# EAGLE design linefollower (EAGLE 9.6.2)
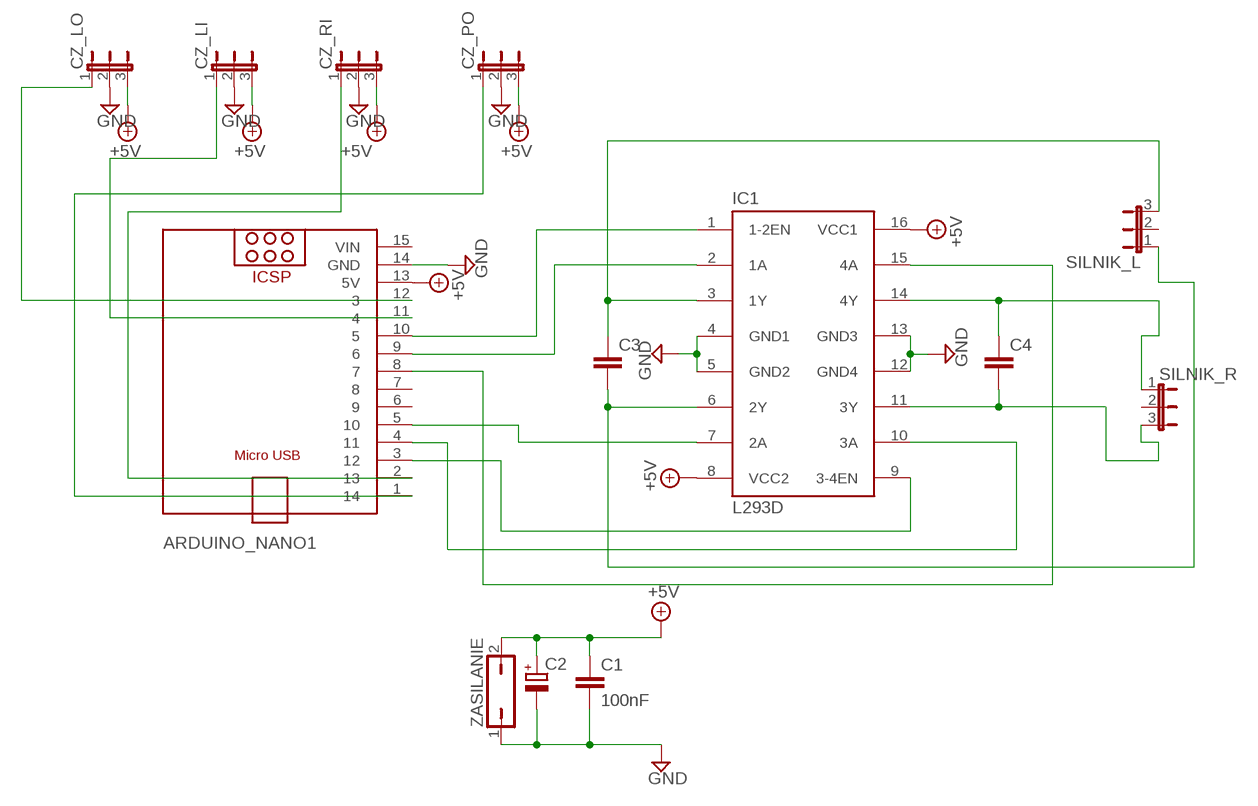
[diagram p0: schematic, sheet 1]

## Parts
ARDUINO_NANO1  MH-TINY  [MH-TINY]
C1  100nF  C-EU025-025X050  [C025-025X050]
C2  CPOL-EUE3.5-8  [E3,5-8]
C3  C-EU050-025X075  [C050-025X075]
C4  C-EU050-025X075  [C050-025X075]
CZ_LI  JP2E  [JP2]
CZ_LO  JP2E  [JP2]
CZ_PO  JP2E  [JP2]
CZ_RI  JP2E  [JP2]
IC1  L293D  [DIL16]
SILNIK_L  JP2E  [JP2]
SILNIK_R  JP2E  [JP2]
ZASILANIE  JP1Q  [JP1]

## Nets
+5V: ARDUINO_NANO1.13(5V) C1.1 C2.+ CZ_LI.3 CZ_LO.3 CZ_PO.3 CZ_RI.3 IC1.8(VCC2) IC1.16(VCC1) ZASILANIE.2
GND: ARDUINO_NANO1.14(GND) C1.2 C2.- CZ_LI.2 CZ_LO.2 CZ_PO.2 CZ_RI.2 IC1.4(GND1) IC1.5(GND2) IC1.12(GND4) IC1.13(GND3) ZASILANIE.1
N$1: ARDUINO_NANO1.12 CZ_LO.1
N$2: ARDUINO_NANO1.1 CZ_PO.1
N$4: ARDUINO_NANO1.2 CZ_RI.1
N$5: C3.1 IC1.3(1Y) SILNIK_L.3
N$6: C3.2 IC1.6(2Y) SILNIK_L.1
N$7: C4.1 IC1.14(4Y) SILNIK_R.1
N$9: ARDUINO_NANO1.10 IC1.1(1-2EN)
N$10: ARDUINO_NANO1.9 IC1.2(1A)
N$11: ARDUINO_NANO1.5 IC1.7(2A)
N$12: ARDUINO_NANO1.8 IC1.15(4A)
N$13: ARDUINO_NANO1.4 IC1.10(3A)
N$14: ARDUINO_NANO1.3 IC1.9(3-4EN)
N$15: C4.2 IC1.11(3Y) SILNIK_R.3
N$16: ARDUINO_NANO1.11 CZ_LI.1
Unconnected: ARDUINO_NANO1.6 ARDUINO_NANO1.7 SILNIK_L.2 SILNIK_R.2

## Power pins joined to a net without a drawn wire
VIN: ARDUINO_NANO1.15(VIN)

## Library data of the parts
ARDUINO_NANO1 = MH-TINY:MH-TINY: MH-TINY
C1 C3 C4 = rcl:C-EU: CAPACITOR, European symbol; SPICEPREFIX: C
C2 = rcl:CPOL-EU: POLARIZED CAPACITOR, European symbol; SPICEPREFIX: C
CZ_LI CZ_LO CZ_PO CZ_RI SILNIK_L SILNIK_R = jumper:JP2E: JUMPER
IC1 = st-microelectronics:L293D: PUSH-PULL 4 CHANNEL DRIVER; MPN: L293D; OC_FARNELL: 9589619; OC_NEWARK: 56P8249
ZASILANIE = jumper:JP1Q: JUMPER

## Board
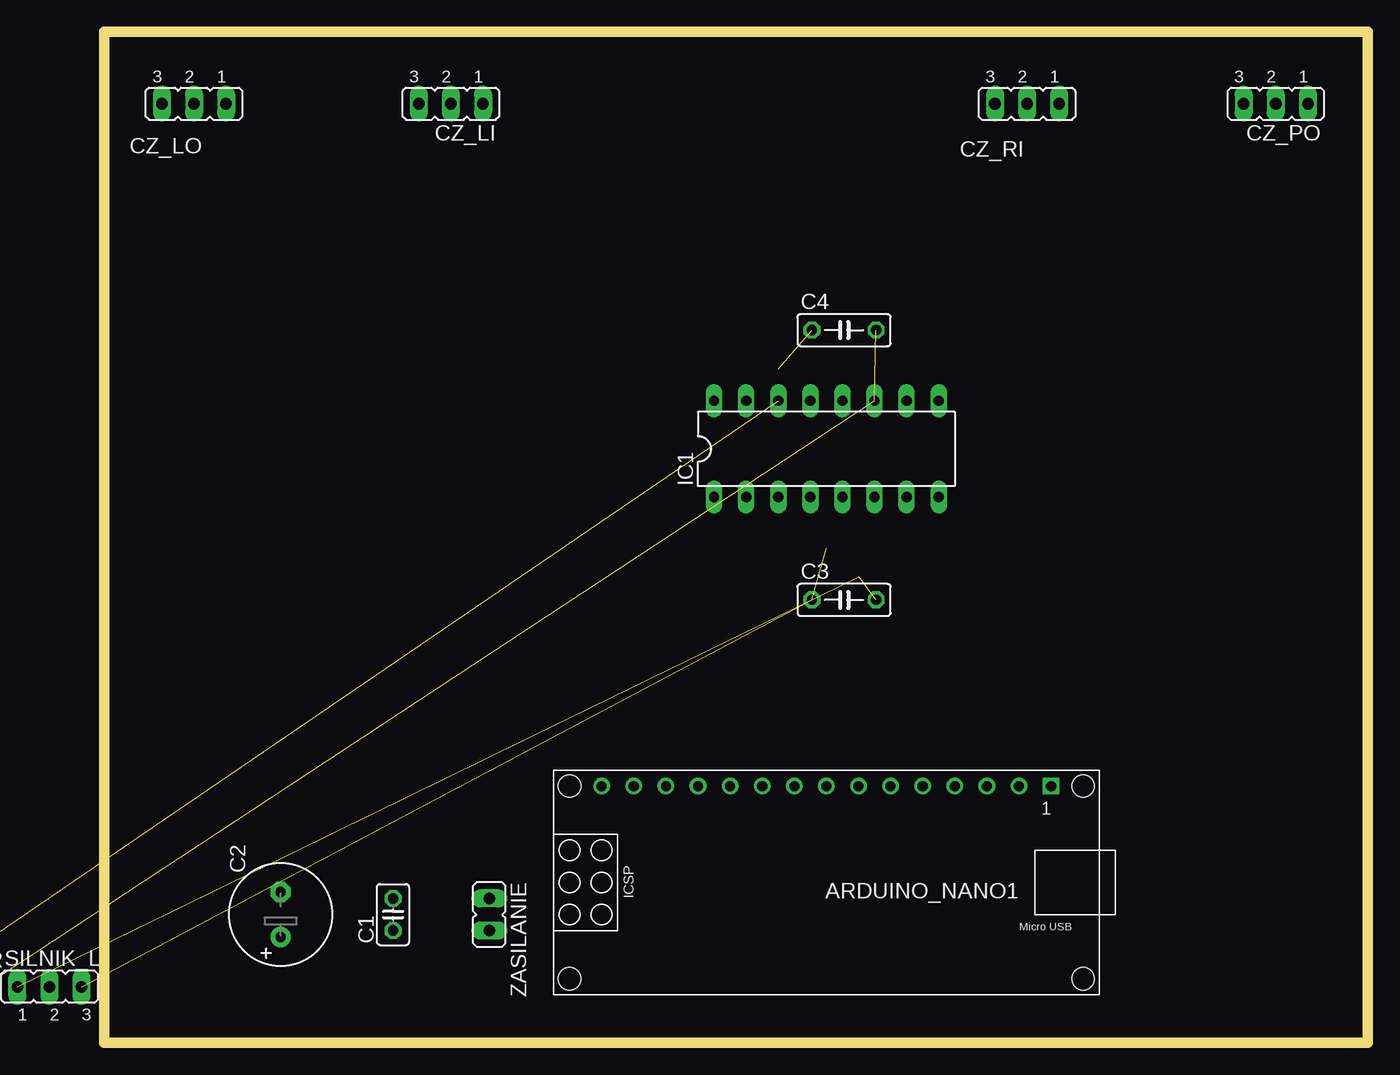
[diagram p1: board, top side]
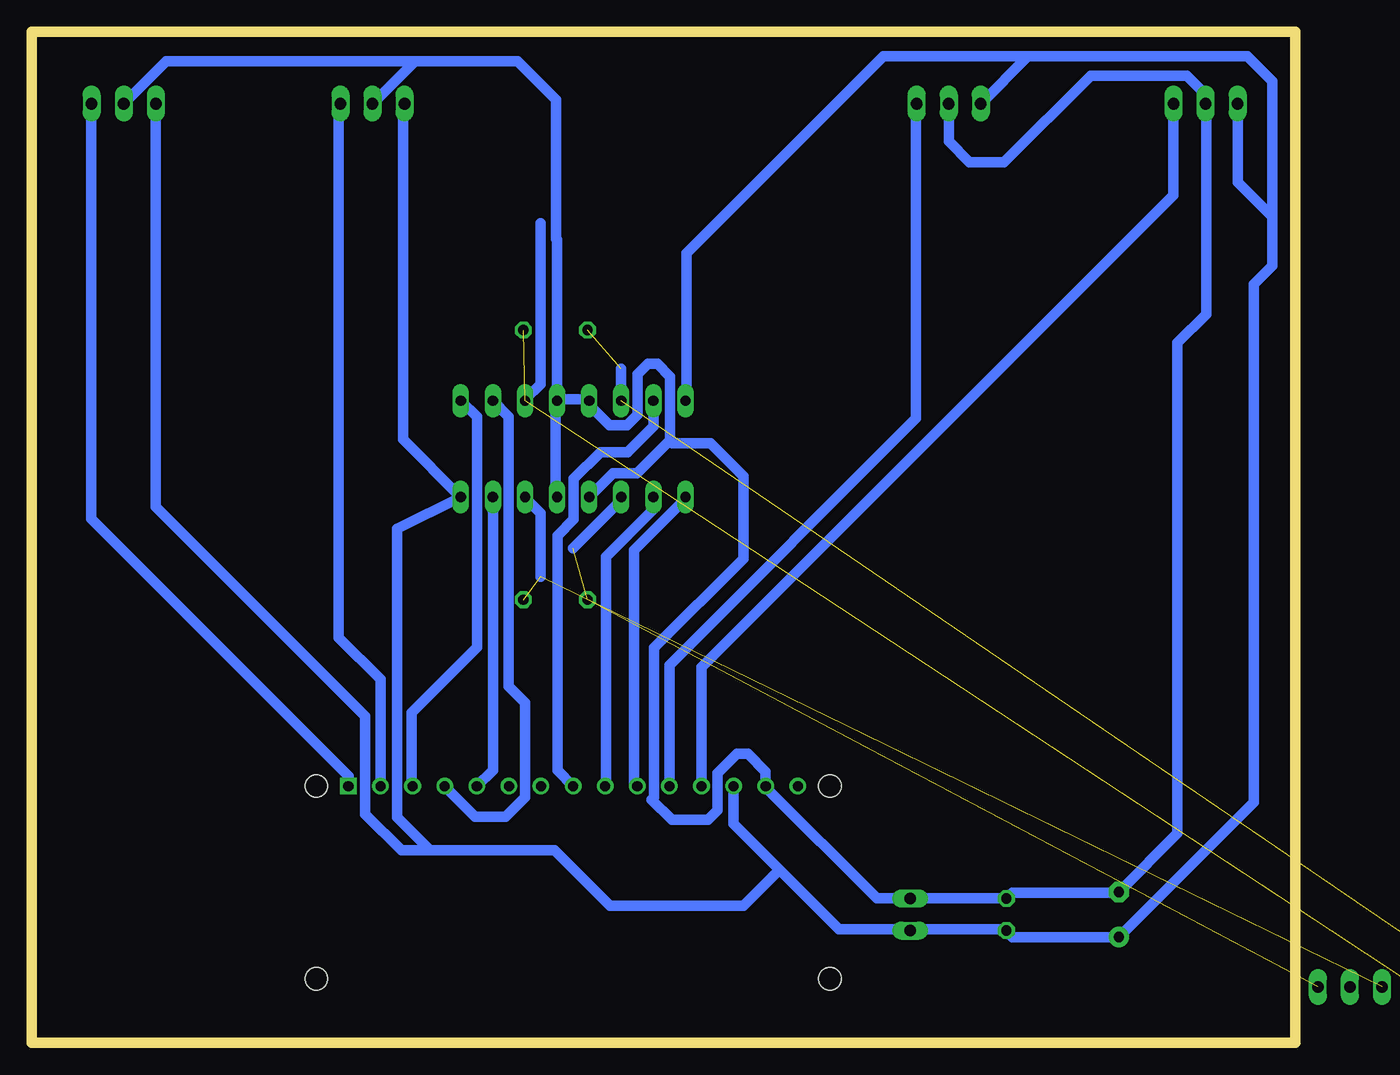
[diagram p2: board, bottom side, seen from below]

Size 100 x 80 mm. Coordinates in mm from the lower left corner, seen from the top.
Outline: 0,0 100,0 100,80 0,80 0,0
Copper layers (1*16): Top 0.035mm / dielectric 1.5mm / Bottom 0.035mm
Design rules "default": minimum track width 6mil, minimum drill 0.35mm, track to track 6mil, track to pad 6mil, pad to pad 6mil, via to via 6mil, smd to smd 6mil, copper to edge 40mil, drill to drill 6mil, minimum pad ring 10mil, minimum via ring 8mil, stop-mask expansion 4mil, vias tented up to drill 0mil, thermal gap 10mil

### Footprints (pad centres in the part's own frame; a part is rotated, then mirrored left to right if it is on the bottom)
MH-TINY = drill 0.8 square: 1 -20.32,-7.62 | drill 0.8: 2 -17.78,-7.62; 3 -15.24,-7.62; 4 -12.7,-7.62; 5 -10.16,-7.62; 6 -7.62,-7.62; 7 -5.08,-7.62; 8 -2.54,-7.62; 9 0,-7.62; 10 2.54,-7.62; 11 5.08,-7.62; 12 7.62,-7.62; 13 10.16,-7.62; 14 12.7,-7.62; 15 15.24,-7.62 | hole 1.778: -22.86,-7.62; -22.86,7.62; 17.78,7.62; 17.78,-7.62
C025-025X050 = drill 0.813 octagon: 1 -1.27,0; 2 1.27,0
E3,5-8 = drill 0.813 pad 1.6: + -1.778,0 | drill 0.813 pad 1.6 octagon: - 1.778,0
C050-025X075 = drill 0.813 octagon: 1 -2.54,0; 2 2.54,0
JP2 = drill 0.914 long: 1 -2.54,0; 2 0,0; 3 2.54,0
DIL16 = drill 0.813 long: 1 -8.89,-3.81; 2 -6.35,-3.81; 3 -3.81,-3.81; 4 -1.27,-3.81; 5 1.27,-3.81; 6 3.81,-3.81; 7 6.35,-3.81; 8 8.89,-3.81; 9 8.89,3.81; 10 6.35,3.81; 11 3.81,3.81; 12 1.27,3.81; 13 -1.27,3.81; 14 -3.81,3.81; 15 -6.35,3.81; 16 -8.89,3.81
JP1 = drill 0.914 long: 1 0,-1.27; 2 0,1.27

### Placement (x,y rotation side)
ARDUINO_NANO1  54.61,12.7 180 top
C1  22.86,10.16 90 top
C2  13.97,10.16 90 top
C3  58.55,35.05 0 top
C4  58.55,56.39 0 top
CZ_LI  27.43,74.3 180 top
CZ_LO  7.11,74.3 180 top
CZ_PO  92.71,74.3 180 top
CZ_RI  73.03,74.3 180 top
IC1  57.15,46.99 0 top
SILNIK_L  -4.32,4.45 0 top
SILNIK_R  -12.32,4.32 0 top  (outside the outline)
ZASILANIE  30.48,10.16 180 top

### Tracks (layer width: path | path; a pad name or v marks a point on that pad's centre or on a via)
+5V
  Bottom 0.813: IC1.16 48.16,50.9 48.16,62.48 32.6,78.04 21.14,78.04 | ARDUINO_NANO1.13 44.45,17.32 40.84,13.71 | 40.84,13.71 36.12,8.99 30.48,8.99 | 30.48,8.99 22.86,8.99 C1.1 22.86,8.84 22.4,8.38 C2.+ | 30.48,8.99 ZASILANIE.2 | 13.87,8.38 C2.+ | 68.45,15.24 71.08,17.87 71.08,40.66 IC1.8 70.61,47.75 70.61,74.17 CZ_RI.3 | 68.45,15.24 70.74,15.24 73.6,18.1 73.6,20.82 73.6,20.83 73.6,25.84 90.17,42.42 CZ_PO.3 | C2.+ 3.3,19.05 3.3,60.01 1.83,61.48 1.83,65.34 | 21.14,78.04 3.81,78.04 1.83,76.06 1.83,65.34 | 21.14,78.04 CZ_LI.3 | CZ_LO.3 4.57,68.08 1.83,65.34 | 68.45,15.24 58.61,15.24 54.23,10.86 43.69,10.86 40.84,13.71
GND
  Bottom 0.813: IC1.5 58.52,43.28 58.52,50.75 IC1.12 | 55.69,43.18 IC1.4 54,45.06 52.09,45.06 49.48,47.68 49.48,52.72 50.48,53.72 51.22,53.72 52.05,52.9 52.05,49.68 52.88,48.84 54.25,48.84 55.88,50.47 IC1.13 55.93,50.9 58.37,50.9 IC1.12 | IC1.12 58.42,63.53 58.48,63.6 58.48,74.61 61.53,77.66 69.66,77.66 | 69.66,77.66 CZ_RI.2 | 69.66,77.66 89.34,77.66 CZ_PO.2 | CZ_LI.2 27.43,71.31 25.78,69.66 23.05,69.66 16.19,76.52 8.57,76.52 7.11,75.06 CZ_LO.2 | CZ_LO.2 7.05,74.23 7.05,57.66 9.34,55.37 9.34,16.57 C2.- 14.02,11.89 22.4,11.89 C1.2 ZASILANIE.1 33.12,11.43 41.96,20.27 41.91,20.27 ARDUINO_NANO1.14 41.91,21.46 43.31,22.86 44.2,22.86 45.72,21.34 45.72,18.41 46.48,17.65 49.34,17.65 50.93,19.24 50.74,19.43 50.74,31.25 43.69,38.31 43.69,44.83 46.29,47.43 49.28,47.43 | CZ_LO.2 7.11,74.49 7.37,74.74
N$1
  Bottom 0.813: ARDUINO_NANO1.12 46.99,29.72 9.65,67.06 CZ_LO.1
N$2
  Bottom 0.813: ARDUINO_NANO1.1 74.93,21.08 95.3,41.45 95.3,74.24 CZ_PO.1
N$4
  Bottom 0.813: ARDUINO_NANO1.2 72.39,28.77 75.69,32.07 75.69,74.17 CZ_RI.1
N$5  (2 unrouted)
  Bottom 0.813: IC1.3 53.34,42.93 57.15,39.12
N$6  (2 unrouted)
  Bottom 0.813: 59.74,36.88 59.74,41.91 60.96,43.13 IC1.6
N$7  (2 unrouted)
  Bottom 0.813: 53.34,53.34 IC1.14
N$9
  Bottom 0.813: ARDUINO_NANO1.10 52.35,20.6 52.35,38.96 48.26,43.05 IC1.1
N$10
  Bottom 0.813: IC1.2 50.8,42.22 54.56,38.46 54.56,20.42 ARDUINO_NANO1.9
N$11
  Bottom 0.813: ARDUINO_NANO1.5 63.5,21.59 IC1.7
N$12
  Bottom 0.813: ARDUINO_NANO1.8 58.4,21.57 58.4,40.13 57.1,41.43 57.1,44.63 54.99,46.74 52.86,46.74 50.8,48.8 IC1.15 50.8,49.84
N$13
  Bottom 0.813: IC1.10 62.24,49.54 62.24,28.21 60.96,26.92 60.96,19.43 62.48,17.91 64.9,17.91 ARDUINO_NANO1.4 67.21,20.42
N$14
  Bottom 0.813: ARDUINO_NANO1.3 69.93,20.4 69.93,26.14 64.76,31.3 64.76,49.52 IC1.9
N$15  (2 unrouted)
  Bottom 0.813: IC1.11 60.96,50.9 59.74,52.12 59.74,64.83
N$16
  Bottom 0.813: ARDUINO_NANO1.11 49.53,29.9 30.02,49.4 30.02,74.24 CZ_LI.1